# Altium schematic sheet Balance.SchDoc
size A4
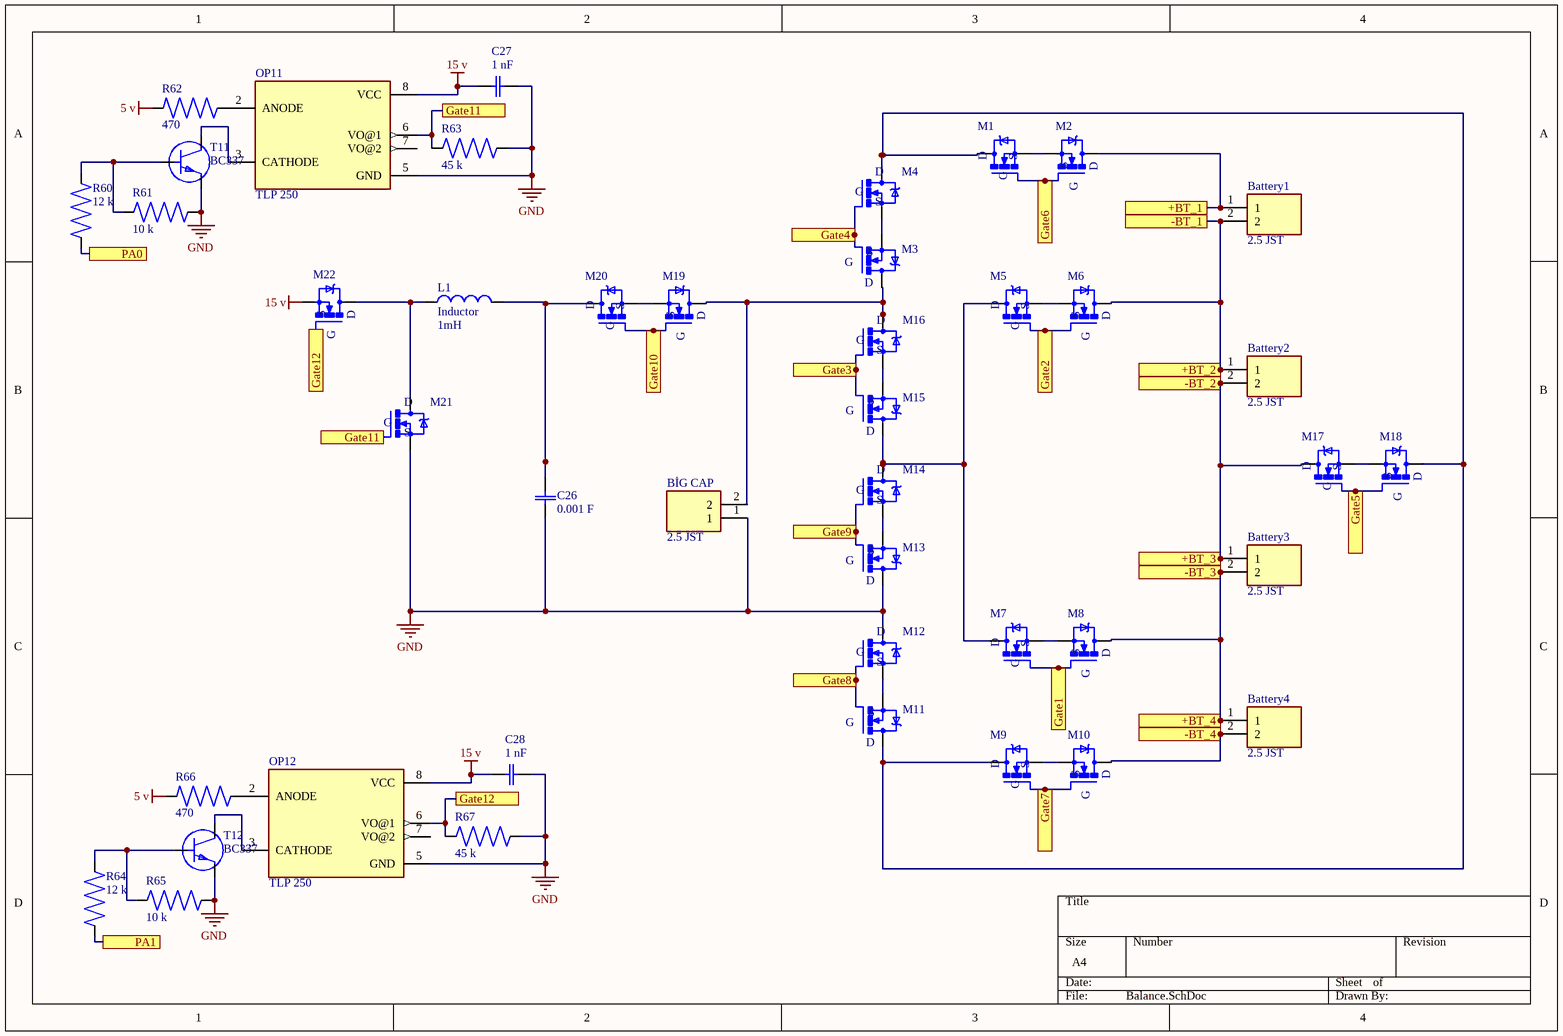
[diagram p0: Balance.SchDoc]

## Parts
Battery1  2.5 JST  [2.5 JST]
Battery2  2.5 JST  [2.5 JST]
Battery3  2.5 JST  [2.5 JST]
Battery4  2.5 JST  [2.5 JST]
BİG_CAP  2.5 JST  [2.5 JST]
C26  0.001 F  [0805-c]
C27  1 nF  [0805-c]
C28  1 nF  [0805-c]
L1  Inductor  value 1mH  [0402-A]
M1  (no value)  [TO-220]
M2  (no value)  [TO-220]
M3  (no value)  [TO-220]
M4  (no value)  [TO-220]
M5  (no value)  [TO-220]
M6  (no value)  [TO-220]
M7  (no value)  [TO-220]
M8  (no value)  [TO-220]
M9  (no value)  [TO-220]
M10  (no value)  [TO-220]
M11  (no value)  [TO-220]
M12  (no value)  [TO-220]
M13  (no value)  [TO-220]
M14  (no value)  [TO-220]
M15  (no value)  [TO-220]
M16  (no value)  [TO-220]
M17  (no value)  [TO-220]
M18  (no value)  [TO-220]
M19  (no value)  [TO-220]
M20  (no value)  [TO-220]
M21  (no value)  [TO-220]
M22  (no value)  [TO-220]
OP11  TLP 250  [TLP 250]
OP12  TLP 250  [TLP 250]
R60  12 k  [10 k]
R61  10 k  [10 k]
R62  470  [10 k]
R63  45 k  [10 k]
R64  12 k  [10 k]
R65  10 k  [10 k]
R66  470  [10 k]
R67  45 k  [10 k]
T11  BC337  [BC337]
T12  BC337  [BC337]

## Ports
+BT_1, +BT_2, +BT_3, +BT_4, -BT_1, -BT_2, -BT_3, -BT_4, Gate1, Gate2, Gate3, Gate4, Gate5, Gate6, Gate7, Gate8, Gate9, Gate10, Gate11, Gate12, PA0, PA1

## Nets
5 v: R62.1 R66.1
15 v: C27.1(C1) C28.1(C1) M22.S OP11.8(VCC) OP12.8(VCC)
GND: BİG_CAP.1 C26.1(C1) C27.2(C2) C28.2(C2) M12.D M13.D M21.S OP11.5(GND) OP12.5(GND) R61.1 R63.1 R65.1 R67.1 T11.1(E) T12.1(E)
+BT_1: Battery1.1 M2.D ; port +BT_1
+BT_2: Battery1.2 Battery2.1 M6.D ; port -BT_1, port +BT_2
+BT_3: Battery2.2 Battery3.1 M17.D ; port -BT_2, port +BT_3
+BT_4: Battery3.2 Battery4.1 M8.D ; port -BT_3, port +BT_4
-BT_4: Battery4.2 M10.D ; port -BT_4
Gate1: M7.G M8.G ; port Gate1
Gate2: M5.G M6.G ; port Gate2
Gate3: M15.G M16.G ; port Gate3
Gate4: M3.G M4.G ; port Gate4
Gate5: M17.G M18.G ; port Gate5
Gate6: M1.G M2.G ; port Gate6
Gate7: M9.G M10.G ; port Gate7
Gate8: M11.G M12.G ; port Gate8
Gate9: M13.G M14.G ; port Gate9
Gate10: M19.G M20.G ; port Gate10
Gate11: M21.G OP11.6(VO@1) R63.2 ; port Gate11
Gate12: M22.G OP12.6(VO@1) R67.2 ; port Gate12
PA0: R60.2 ; port PA0
PA1: R64.2 ; port PA1
NetBİG_CAP_2: BİG_CAP.2 M3.D M16.D M19.D
NetC26_2: C26.2(C2) L1.2 M20.D
NetL1_1: L1.1 M21.D M22.D
NetM1_D: M1.D M4.D M9.D M11.D M18.D
NetM1_S: M1.S M2.S
NetM3_S: M3.S M4.S
NetM5_D: M5.D M7.D M14.D M15.D
NetM5_S: M5.S M6.S
NetM7_S: M7.S M8.S
NetM9_S: M9.S M10.S
NetM11_S: M11.S M12.S
NetM13_S: M13.S M14.S
NetM15_S: M15.S M16.S
NetM17_S: M17.S M18.S
NetM19_S: M19.S M20.S
NetOP11_2: OP11.2(ANODE) R62.2
NetOP11_3: OP11.3(CATHODE) T11.3(C)
NetOP12_2: OP12.2(ANODE) R66.2
NetOP12_3: OP12.3(CATHODE) T12.3(C)
NetR60_1: R60.1 R61.2 T11.2(B)
NetR64_1: R64.1 R65.2 T12.2(B)

Not connected (* = marked no-connect by the designer): OP11 7(VO@2); OP12 7(VO@2)

## Library data of the parts
C26-C28 = 0805-C
L1 = Inductor: Code_IEC: 1005; Published: 8-Jun-2000; LatestRevisionDate: 29-May-2009; LatestRevisionNote: IPC-7351 Footprint Added.; PackageReference: 0402-A; Publisher: Altium Limited; PackageDescription: Chip Inductor; Code_JEITA: 0402
M1-M22 = TO-220
R60 R62-R64 R66 R67 = 10 k